# Altium schematic sheet PCB_LED_CALENDAR__AMBIENT_LIGHT_SENS.SchDoc
size A4
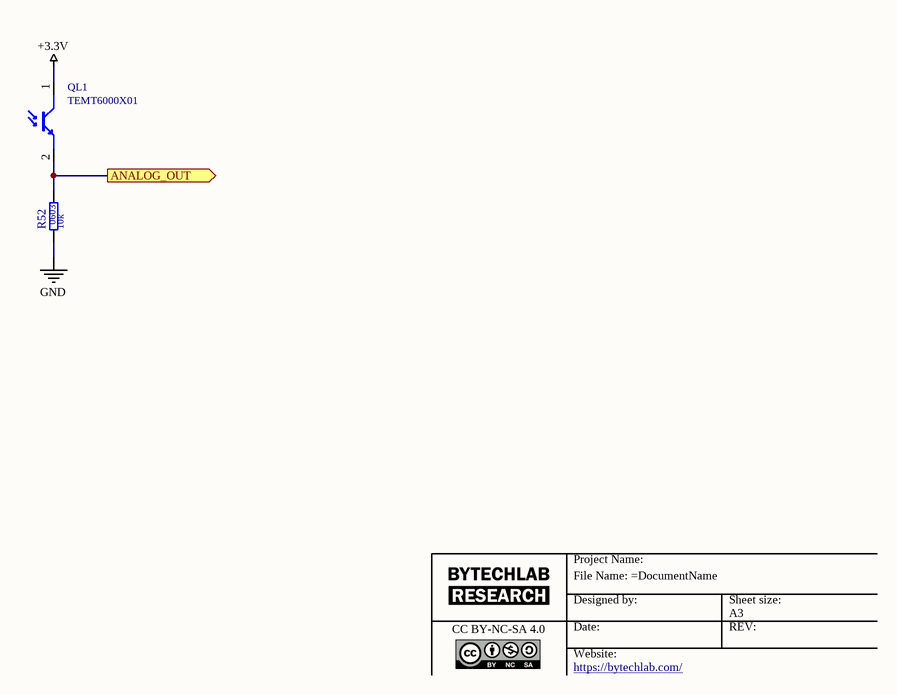
[diagram p0: PCB_LED_CALENDAR__AMBIENT_LIGHT_SENS.SchDoc]

## Parts
QL1  TEMT6000X01  [TEMT6000X01]
R52  value 10k  SCH_Footprint: 0603  [R_0603_1608]  (hidden comment: Resistor)

## Ports
ANALOG_OUT (out)

## Nets
+3.3V: QL1.1
GND: R52.1
ANALOG_OUT: QL1.2 R52.2 ; port ANALOG_OUT

## Notes on the sheet
- Project Name:
- File Name: =DocumentName
- CC BY-NC-SA 4.0
- Designed by:
- Date:
- Website:
- Sheet size:
- A3
- REV:
- https://bytechlab.com/

## Library data of the parts
QL1 = QL_TEMT6000X01: 1206 Ambient Light Sensors ROHS; Manufacturer: Vishay Intertech; Manufacturer Part Number: TEMT6000X01; Supplier 1: JLCPCB; Supplier Part Number 1: C94098
R52 = R_10k_0603_1: Manufacturer: Vishay; Manufacturer Part Number: CRCW060310K0FKTA; Voltage: 75V; Power: 100mW; Tolerance: 1%; Part Number: R_10k_0603_1; HelpURL: https://octopart.com/datasheet/crcw060310k0fkta-vishay-39447548; Supplier 1: TME; Supplier Part Number 1: CRCW060310K0FKTABC; Supplier 2: RS Components; Supplier 3: Farnell; Supplier Part Number 3: 1652827; Supplier 4: Mouser; Supplier Part Number 4: 71-CRCW0603-10K; Supplier 5: Digi-Key; Supplier Part Number 5: 541-2980-1-ND; Supplier 6: LCSC